# Altium schematic sheet Energy.SchDoc
size A4
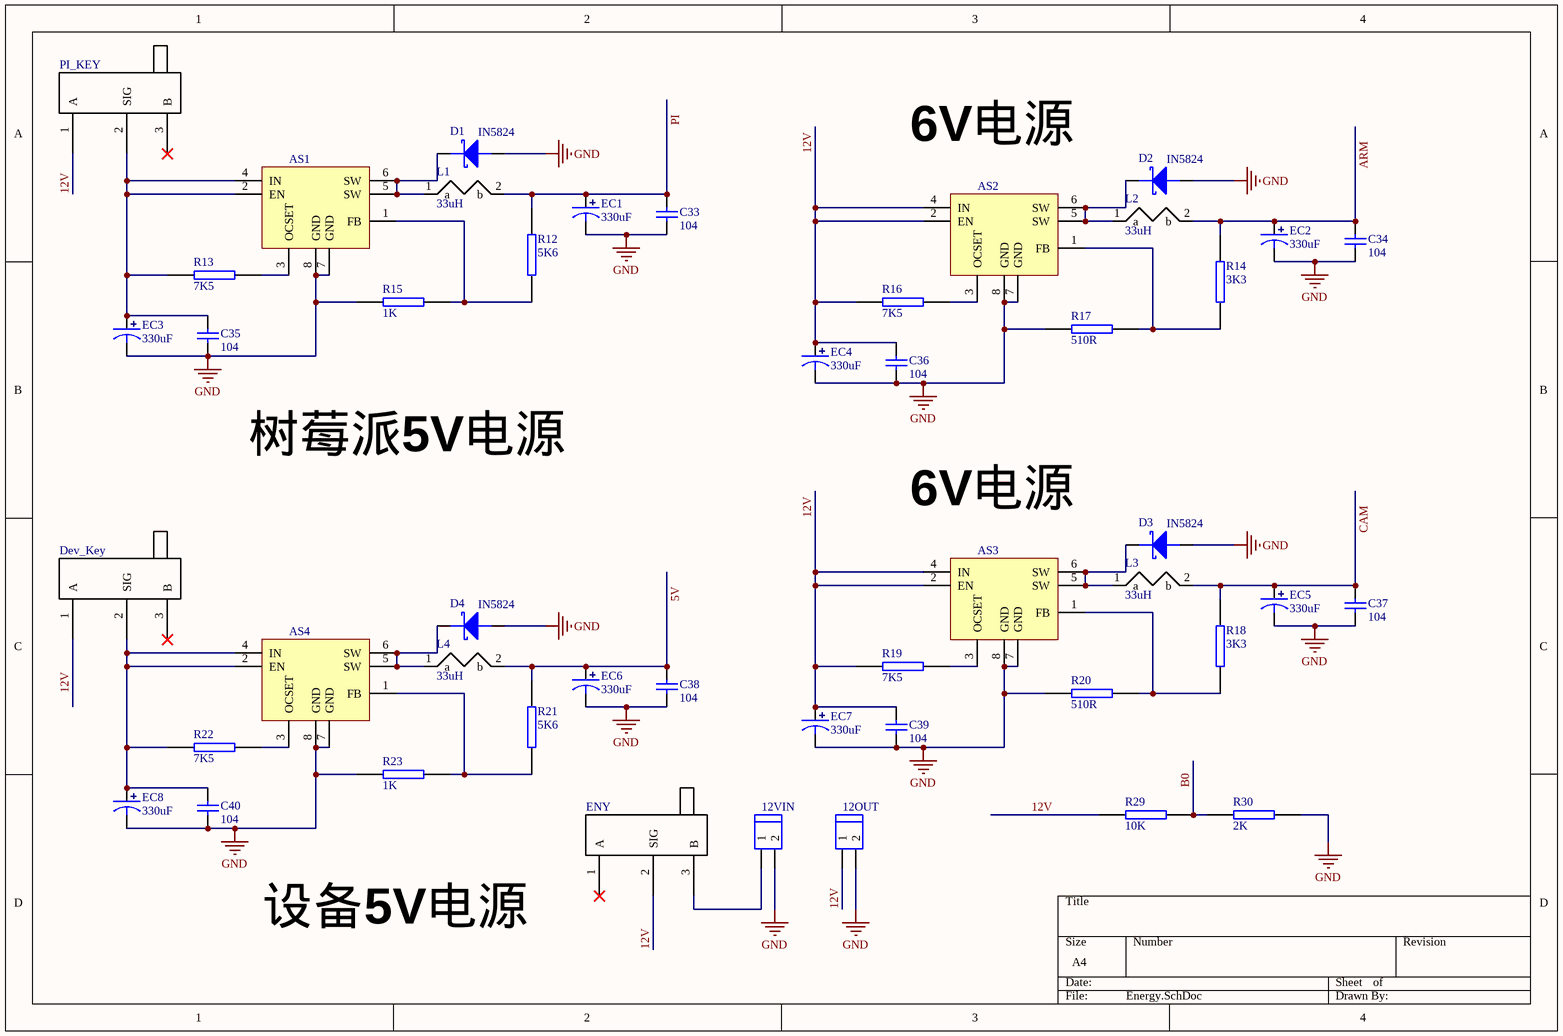
[diagram p0: Energy.SchDoc]

## Parts
12OUT  HEAD2  [HEAD2L-0.8]  (value not drawn)
12VIN  HEAD2  [HEAD2L-0.8]  (value not drawn)
AS1  U1  [AS1015]  (value not drawn)
AS2  U1  [AS1015]  (value not drawn)
AS3  U1  [AS1015]  (value not drawn)
AS4  U1  [AS1015]  (value not drawn)
C33  Cap  [CAP[0805]]  (value not drawn)
C34  Cap  [CAP[0805]]  (value not drawn)
C35  Cap  [CAP[0805]]  (value not drawn)
C36  Cap  [CAP[0805]]  (value not drawn)
C37  Cap  [CAP[0805]]  (value not drawn)
C38  Cap  [CAP[0805]]  (value not drawn)
C39  Cap  [CAP[0805]]  (value not drawn)
C40  Cap  [CAP[0805]]  (value not drawn)
D1  IN5824  [SMA/DO-214AC]
D2  IN5824  [SMA/DO-214AC]
D3  IN5824  [SMA/DO-214AC]
D4  IN5824  [SMA/DO-214AC]
Dev_Key  Dev_Key  [KEY]
EC1  330uF  [DIP-EC5.0X10X12.5]
EC2  330uF  [DIP-EC5.0X10X12.5]
EC3  330uF  [DIP-EC5.0X10X12.5]
EC4  330uF  [DIP-EC5.0X10X12.5]
EC5  330uF  [DIP-EC5.0X10X12.5]
EC6  330uF  [DIP-EC5.0X10X12.5]
EC7  330uF  [DIP-EC5.0X10X12.5]
EC8  330uF  [DIP-EC5.0X10X12.5]
ENY  ENY  [KEY]
L1  33uH  [INDUCTOR]
L2  33uH  [INDUCTOR]
L3  33uH  [INDUCTOR]
L4  33uH  [INDUCTOR]
PI_KEY  PI_KEY  [KEY]
R12  5K6  [R0805]
R13  7K5  [R0805]
R14  3K3  [R0805]
R15  1K  [R0805]
R16  7K5  [R0805]
R17  510R  [R0805]
R18  3K3  [R0805]
R19  7K5  [R0805]
R20  510R  [R0805]
R21  5K6  [R0805]
R22  7K5  [R0805]
R23  1K  [R0805]
R29  10K  [R0805]
R30  2K  [R0805]

## Nets
GND: 12OUT.2 12VIN.2 AS1.7(GND) AS1.8(GND) AS2.7(GND) AS2.8(GND) AS3.7(GND) AS3.8(GND) AS4.7(GND) AS4.8(GND) C33.1 C34.1 C35.1 C36.1 C37.1 C38.1 C39.1 C40.1 D1.A D2.A D3.A D4.A EC1.2 EC2.2 EC3.2 EC4.2 EC5.2 EC6.2 EC7.2 EC8.2 R15.2 R17.2 R20.2 R23.2 R30.2
5V: C38.2 EC6.1 L4.2(b) R21.2
12V: 12OUT.1 AS2.2(EN) AS2.4(IN) AS3.2(EN) AS3.4(IN) C36.2 C39.2 Dev_Key.1(A) EC4.1 EC7.1 ENY.2(SIG) PI_KEY.1(A) R16.1 R19.1 R29.1
ARM: C34.2 EC2.1 L2.2(b) R14.2
B0: R29.2 R30.1
CAM: C37.2 EC5.1 L3.2(b) R18.2
PI: C33.2 EC1.1 L1.2(b) R12.2
Net12VIN_1: 12VIN.1 ENY.3(B)
NetAS1_1: AS1.1(FB) R12.1 R15.1
NetAS1_2: AS1.2(EN) AS1.4(IN) C35.2 EC3.1 PI_KEY.2(SIG) R13.1
NetAS1_3: AS1.3(OCSET) R13.2
NetAS1_5: AS1.5(SW) AS1.6(SW) D1.K L1.1(a)
NetAS2_1: AS2.1(FB) R14.1 R17.1
NetAS2_3: AS2.3(OCSET) R16.2
NetAS2_5: AS2.5(SW) AS2.6(SW) D2.K L2.1(a)
NetAS3_1: AS3.1(FB) R18.1 R20.1
NetAS3_3: AS3.3(OCSET) R19.2
NetAS3_5: AS3.5(SW) AS3.6(SW) D3.K L3.1(a)
NetAS4_1: AS4.1(FB) R21.1 R23.1
NetAS4_2: AS4.2(EN) AS4.4(IN) C40.2 Dev_Key.2(SIG) EC8.1 R22.1
NetAS4_3: AS4.3(OCSET) R22.2
NetAS4_5: AS4.5(SW) AS4.6(SW) D4.K L4.1(a)

Not connected (* = marked no-connect by the designer): Dev_Key 3(B)*; ENY 1(A)*; PI_KEY 3(B)*

## Notes on the sheet
- 6V电源
- 树莓派5V电源
- 设备5V电源
- (in symbol Cap) 104

## Library data of the parts
AS1-AS4 = LED2
D1-D4 = DIODE SCHOTTKY: 肖特基二极管
Dev_Key ENY PI_KEY = key
EC1-EC8 = DIP_ECAP: 直插电解电容
L1-L4 = INDUCTOR
R12-R23 R29 R30 = RES